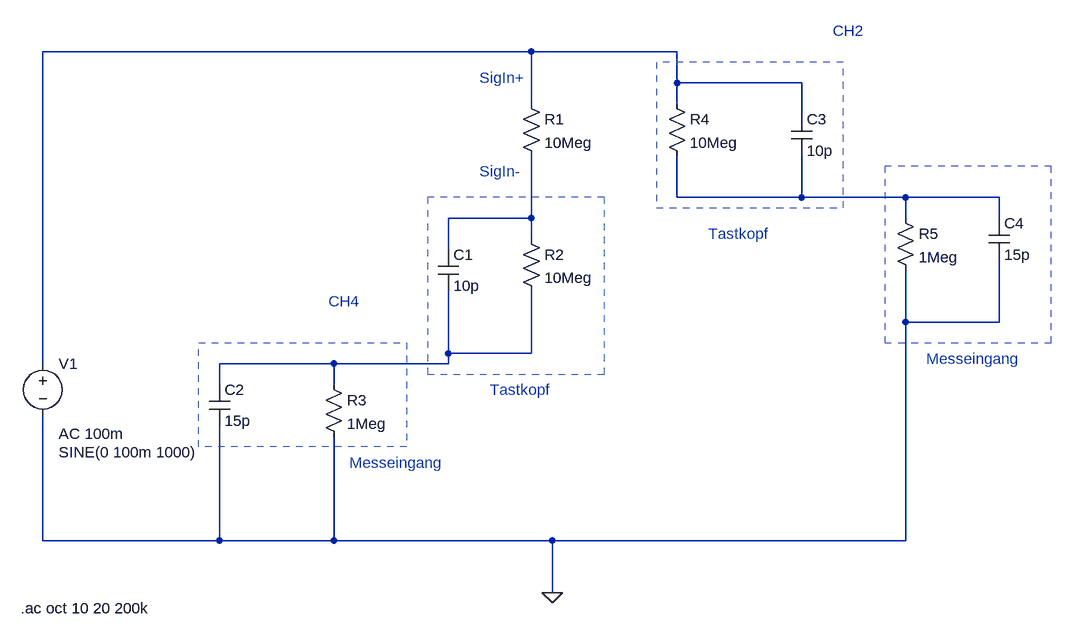
[diagram p0: schematic ESB10MOhmMitOszi.asc]
ESB10MOhmMitOszi.asc, the LTspice schematic file:
Version 4
SHEET 1 1272 920
WIRE 144 48 -608 48
WIRE 368 48 144 48
WIRE 368 96 368 48
WIRE 560 96 368 96
WIRE 144 128 144 48
WIRE 368 128 368 96
WIRE 560 144 560 96
WIRE 368 272 368 208
WIRE 560 272 560 208
WIRE 560 272 368 272
WIRE 720 272 560 272
WIRE 864 272 720 272
WIRE 144 304 144 208
WIRE 144 304 16 304
WIRE 720 304 720 272
WIRE 864 304 864 272
WIRE 144 336 144 304
WIRE 16 352 16 304
WIRE 720 464 720 384
WIRE 864 464 864 368
WIRE 864 464 720 464
WIRE 16 512 16 416
WIRE 144 512 144 416
WIRE 144 512 16 512
WIRE -608 528 -608 48
WIRE -160 528 -336 528
WIRE 16 528 16 512
WIRE 16 528 -160 528
WIRE -336 560 -336 528
WIRE -160 560 -160 528
WIRE -608 800 -608 608
WIRE -336 800 -336 624
WIRE -336 800 -608 800
WIRE -160 800 -160 640
WIRE -160 800 -336 800
WIRE 176 800 -160 800
WIRE 720 800 720 464
WIRE 720 800 176 800
WIRE 176 880 176 800
FLAG 176 880 0
SYMBOL res 128 112 R0
SYMATTR InstName R1
SYMATTR Value 10Meg
SYMBOL res 128 320 R0
SYMATTR InstName R2
SYMATTR Value 10Meg
SYMBOL res -176 544 R0
SYMATTR InstName R3
SYMATTR Value 1Meg
SYMBOL res 352 112 R0
SYMATTR InstName R4
SYMATTR Value 10Meg
SYMBOL cap 544 144 R0
SYMATTR InstName C3
SYMATTR Value 10p
SYMBOL res 704 288 R0
SYMATTR InstName R5
SYMATTR Value 1Meg
SYMBOL cap 848 304 R0
SYMATTR InstName C4
SYMATTR Value 15p
SYMBOL cap 0 352 R0
SYMATTR InstName C1
SYMATTR Value 10p
SYMBOL voltage -608 512 R0
WINDOW 3 24 152 Left 2
WINDOW 123 24 124 Left 2
WINDOW 39 0 0 Left 0
SYMATTR InstName V1
SYMATTR Value SINE(0 100m 1000)
SYMATTR Value2 AC 100m
SYMBOL cap -352 560 R0
SYMATTR InstName C2
SYMATTR Value 15p
TEXT -642 904 Left 2 !.ac oct 10 20 200k
TEXT 608 16 Left 2 ;CH2
TEXT 416 328 Left 2 ;Tastkopf
TEXT 752 520 Left 2 ;Messeingang
TEXT -168 432 Left 2 ;CH4
TEXT 80 568 Left 2 ;Tastkopf
TEXT -136 680 Left 2 ;Messeingang
TEXT 64 88 Left 2 ;SigIn+
TEXT 64 232 Left 2 ;SigIn-
RECTANGLE Normal 624 64 336 288 2
RECTANGLE Normal 944 224 688 496 2
RECTANGLE Normal -368 496 -48 656 2
RECTANGLE Normal 256 272 -16 544 2

The netlist it stands for:
* ESB10MOhmMitOszi.asc
R1 N001 N003 10Meg
R2 N003 N004 10Meg
R3 N004 0 1Meg
R4 N001 N002 10Meg
C3 N001 N002 10p
R5 N002 0 1Meg
C4 N002 0 15p
C1 N003 N004 10p
V1 N001 0 SINE(0 100m 1000) AC 100m
C2 N004 0 15p
.ac oct 10 20 200k
* CH2
* Tastkopf
* Messeingang
* CH4
* Tastkopf
* Messeingang
* SigIn+
* SigIn-
.backanno
.end